# EAGLE schematic RK3188-EVB_Rev_C (EAGLE 9.6.2)
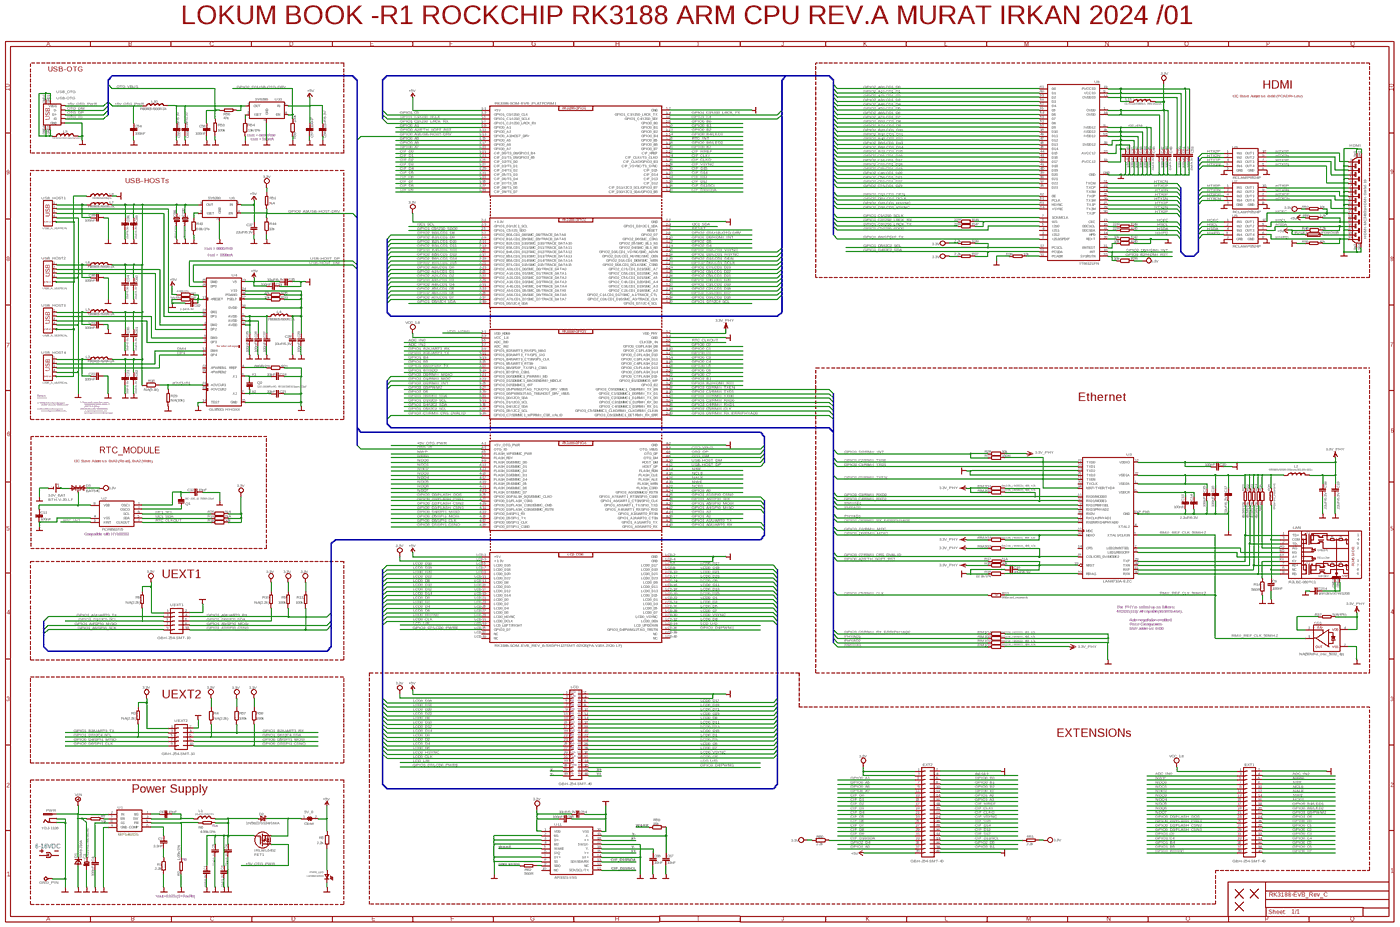
[diagram p0: schematic, sheet 1, overview]
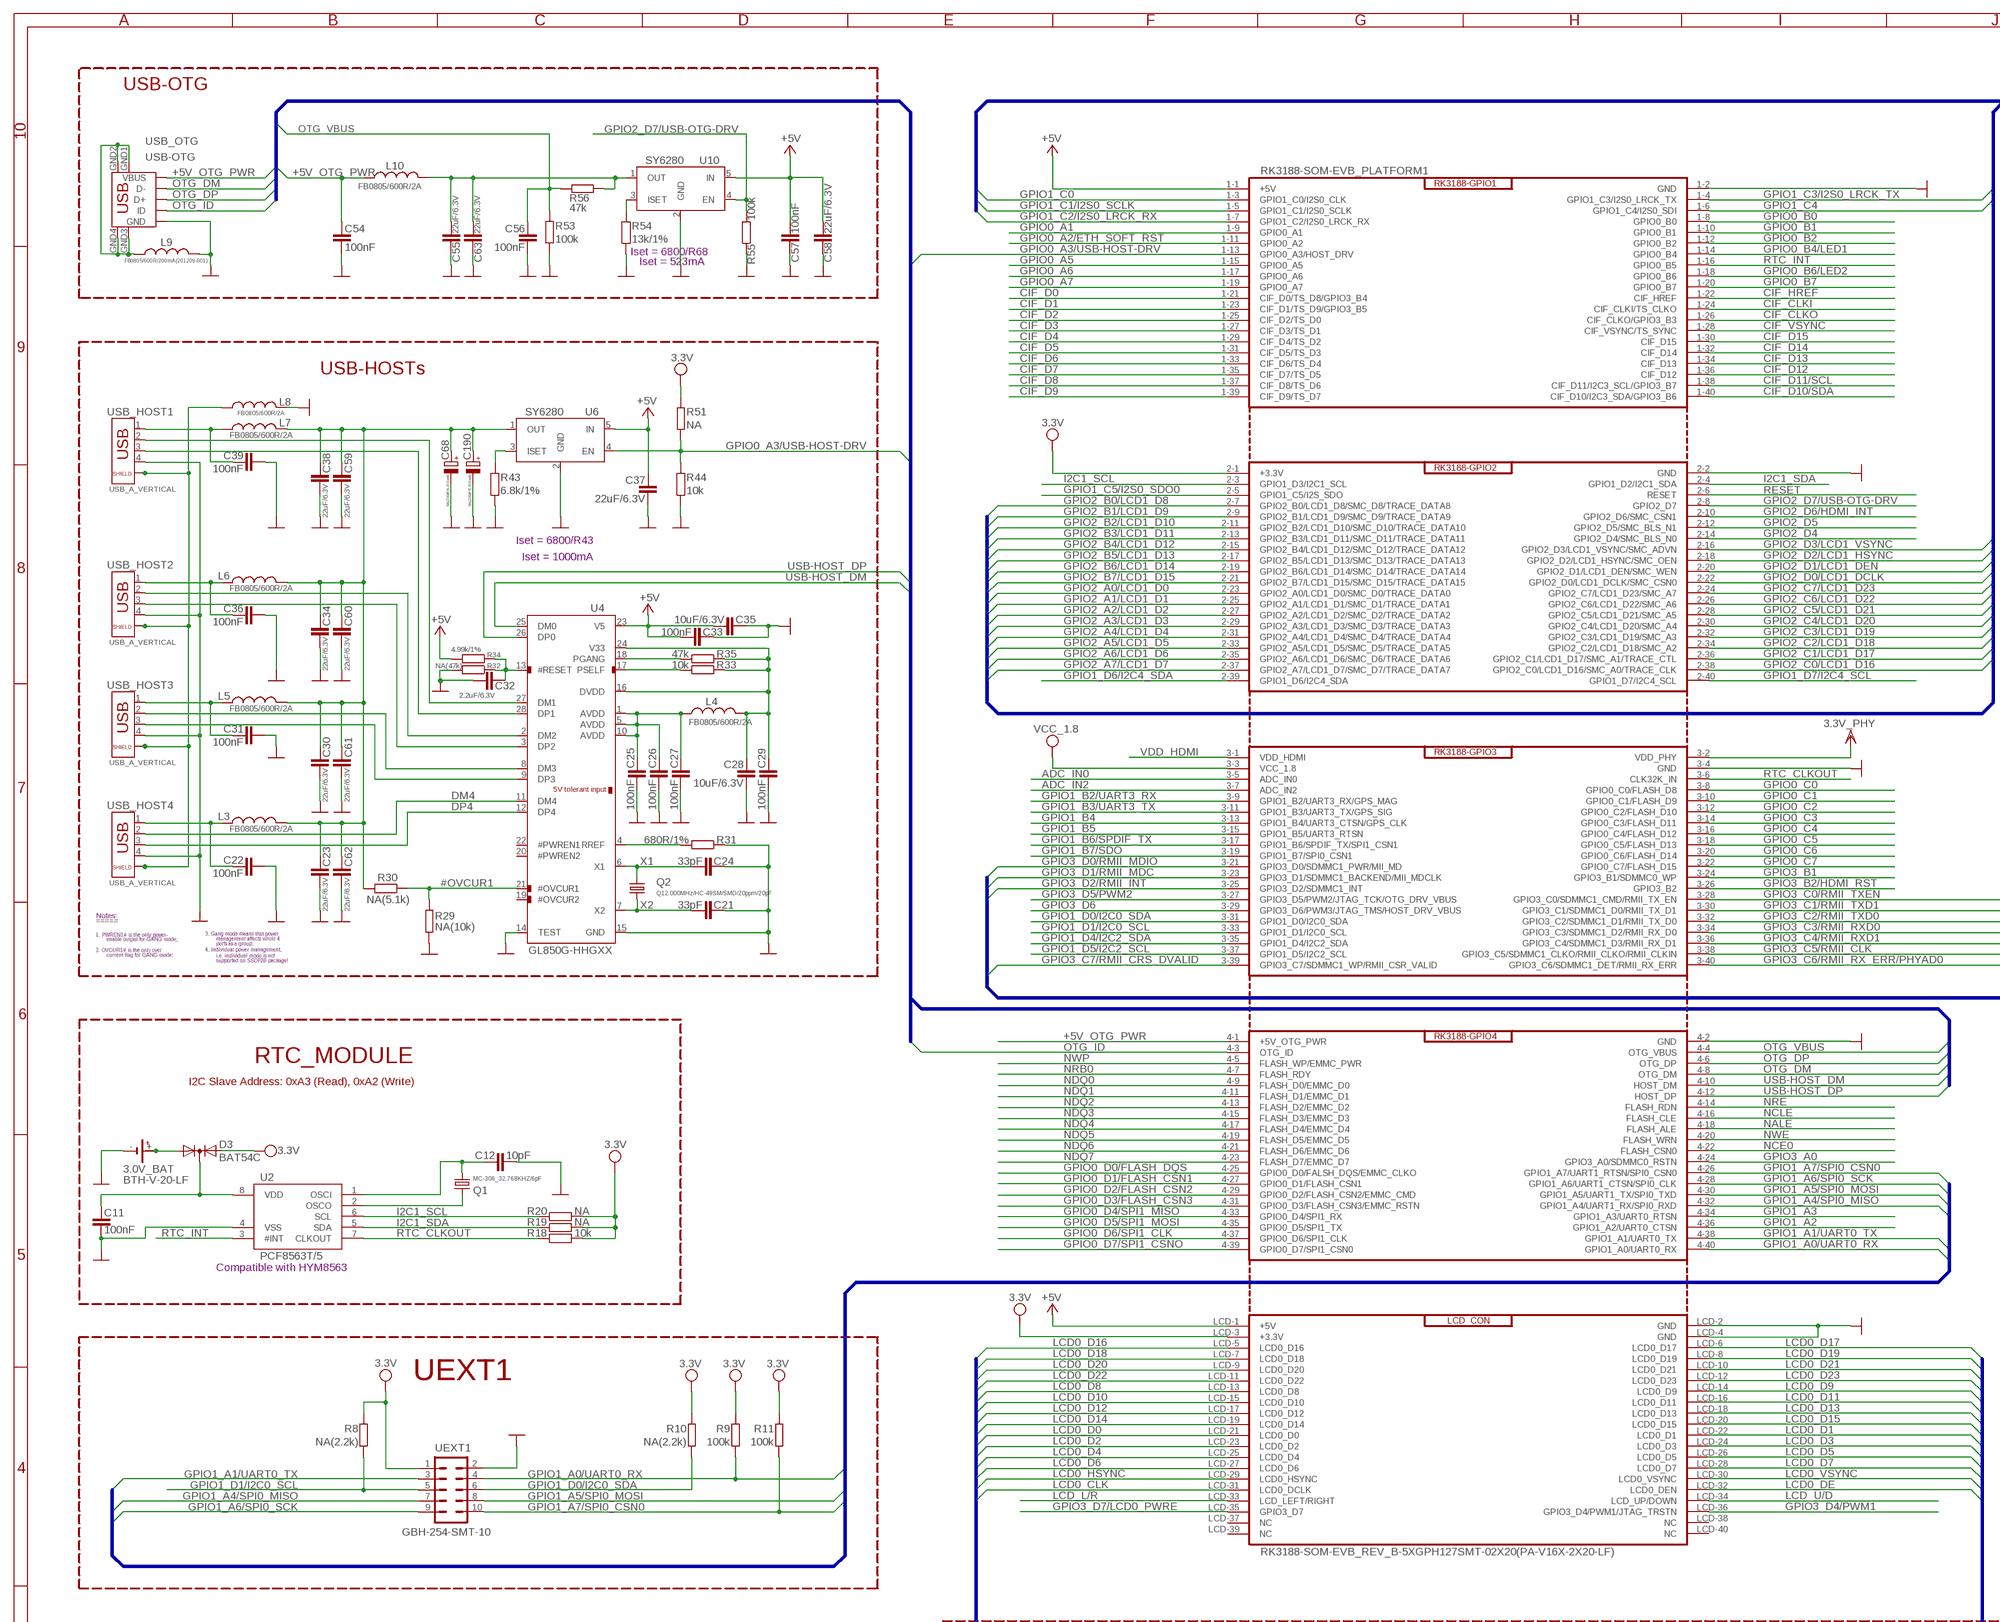
[diagram p1: schematic, sheet 1, part 1 of 4]
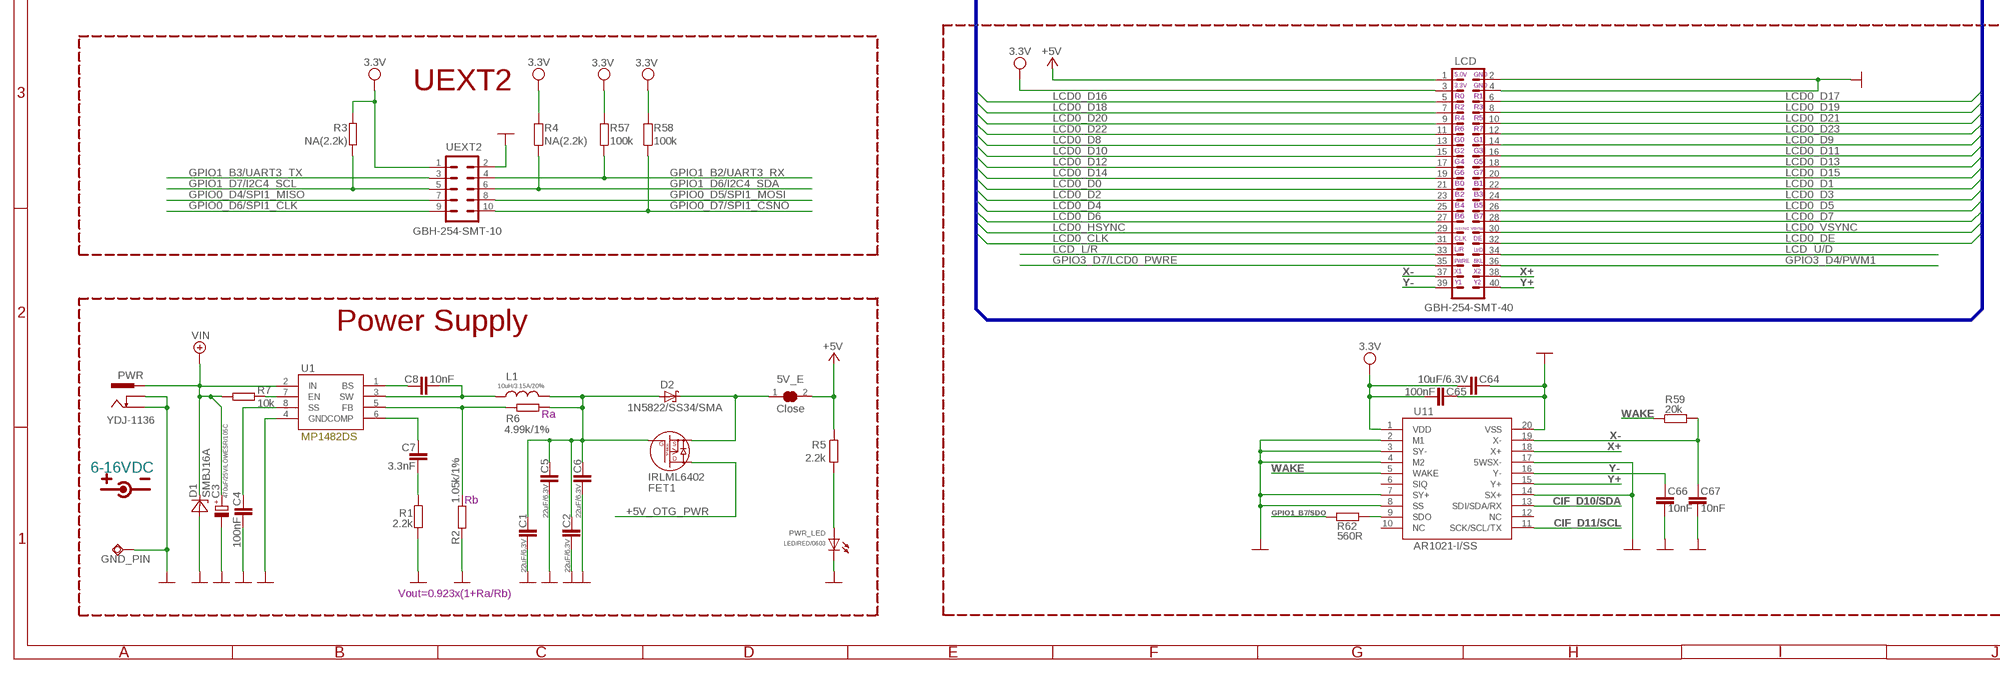
[diagram p2: schematic, sheet 1, part 2 of 4]
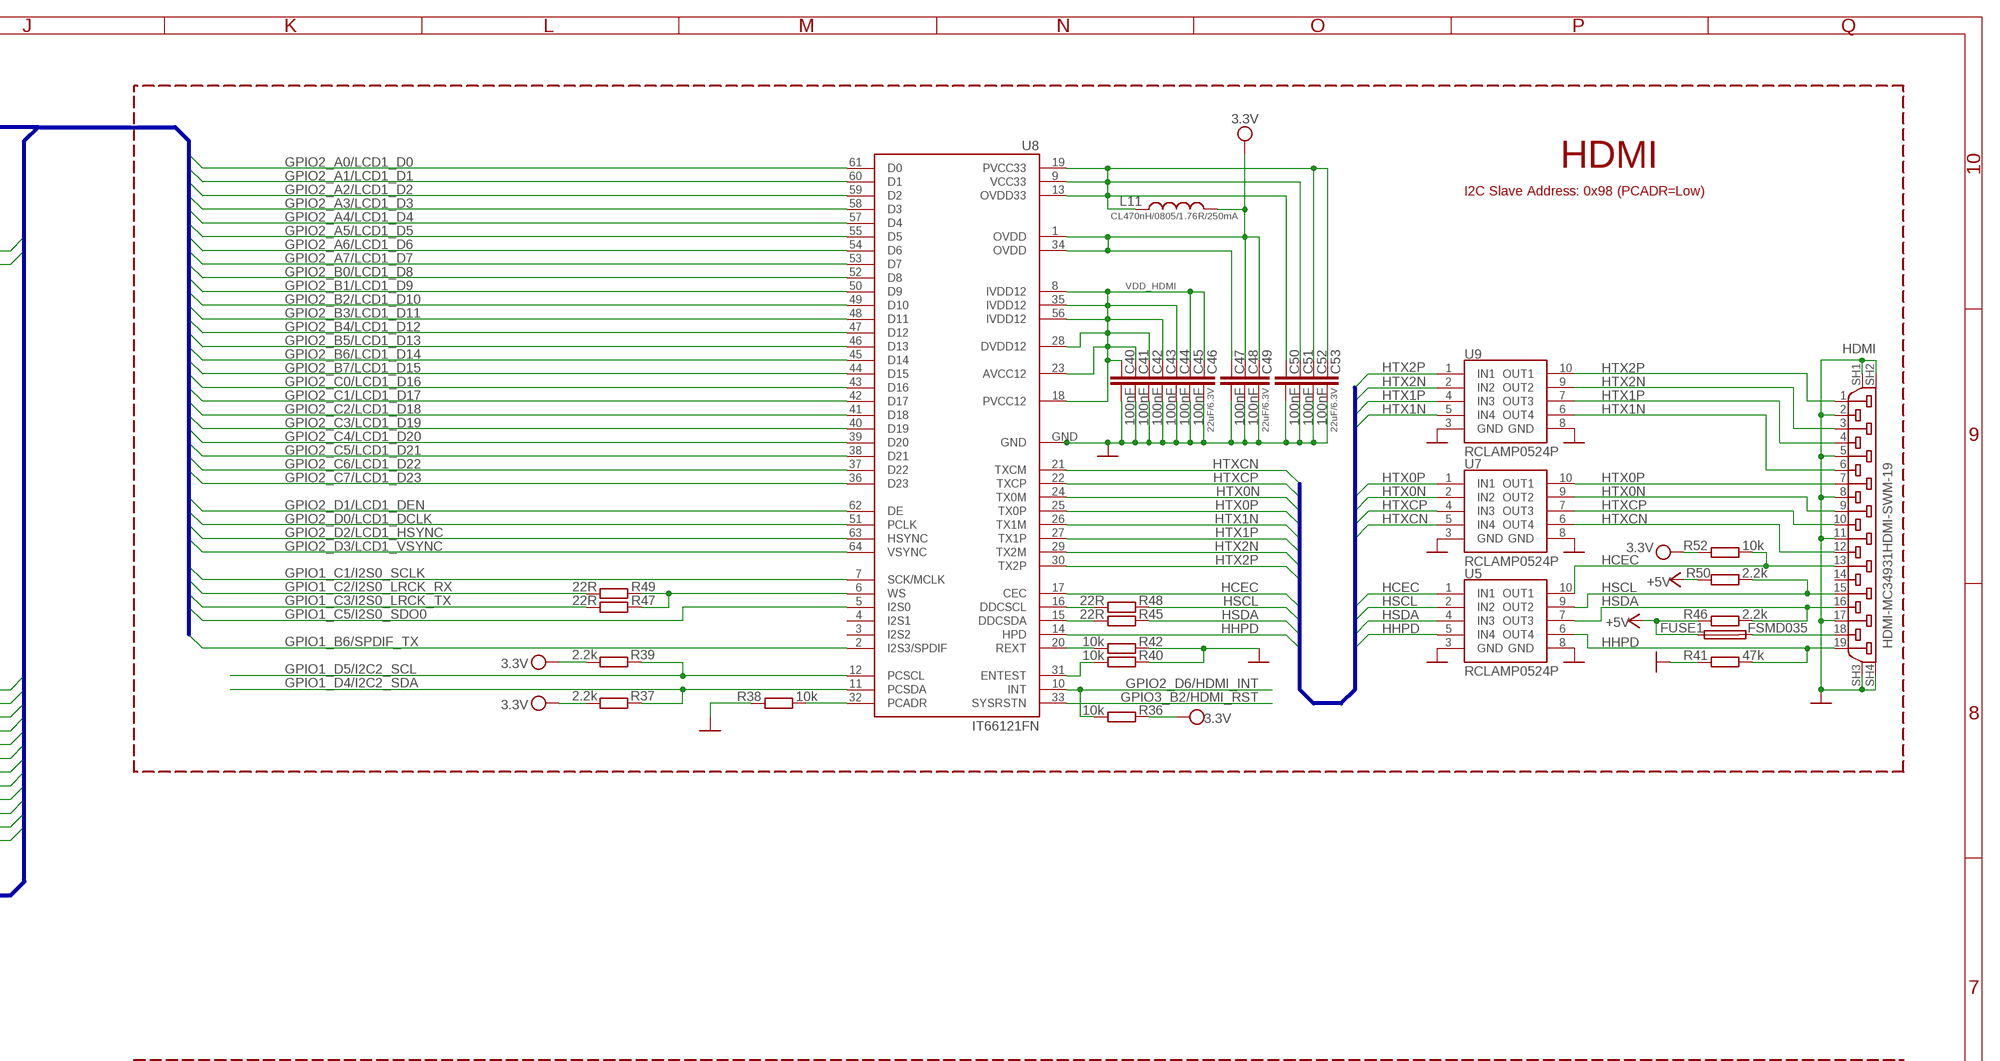
[diagram p3: schematic, sheet 1, part 3 of 4]
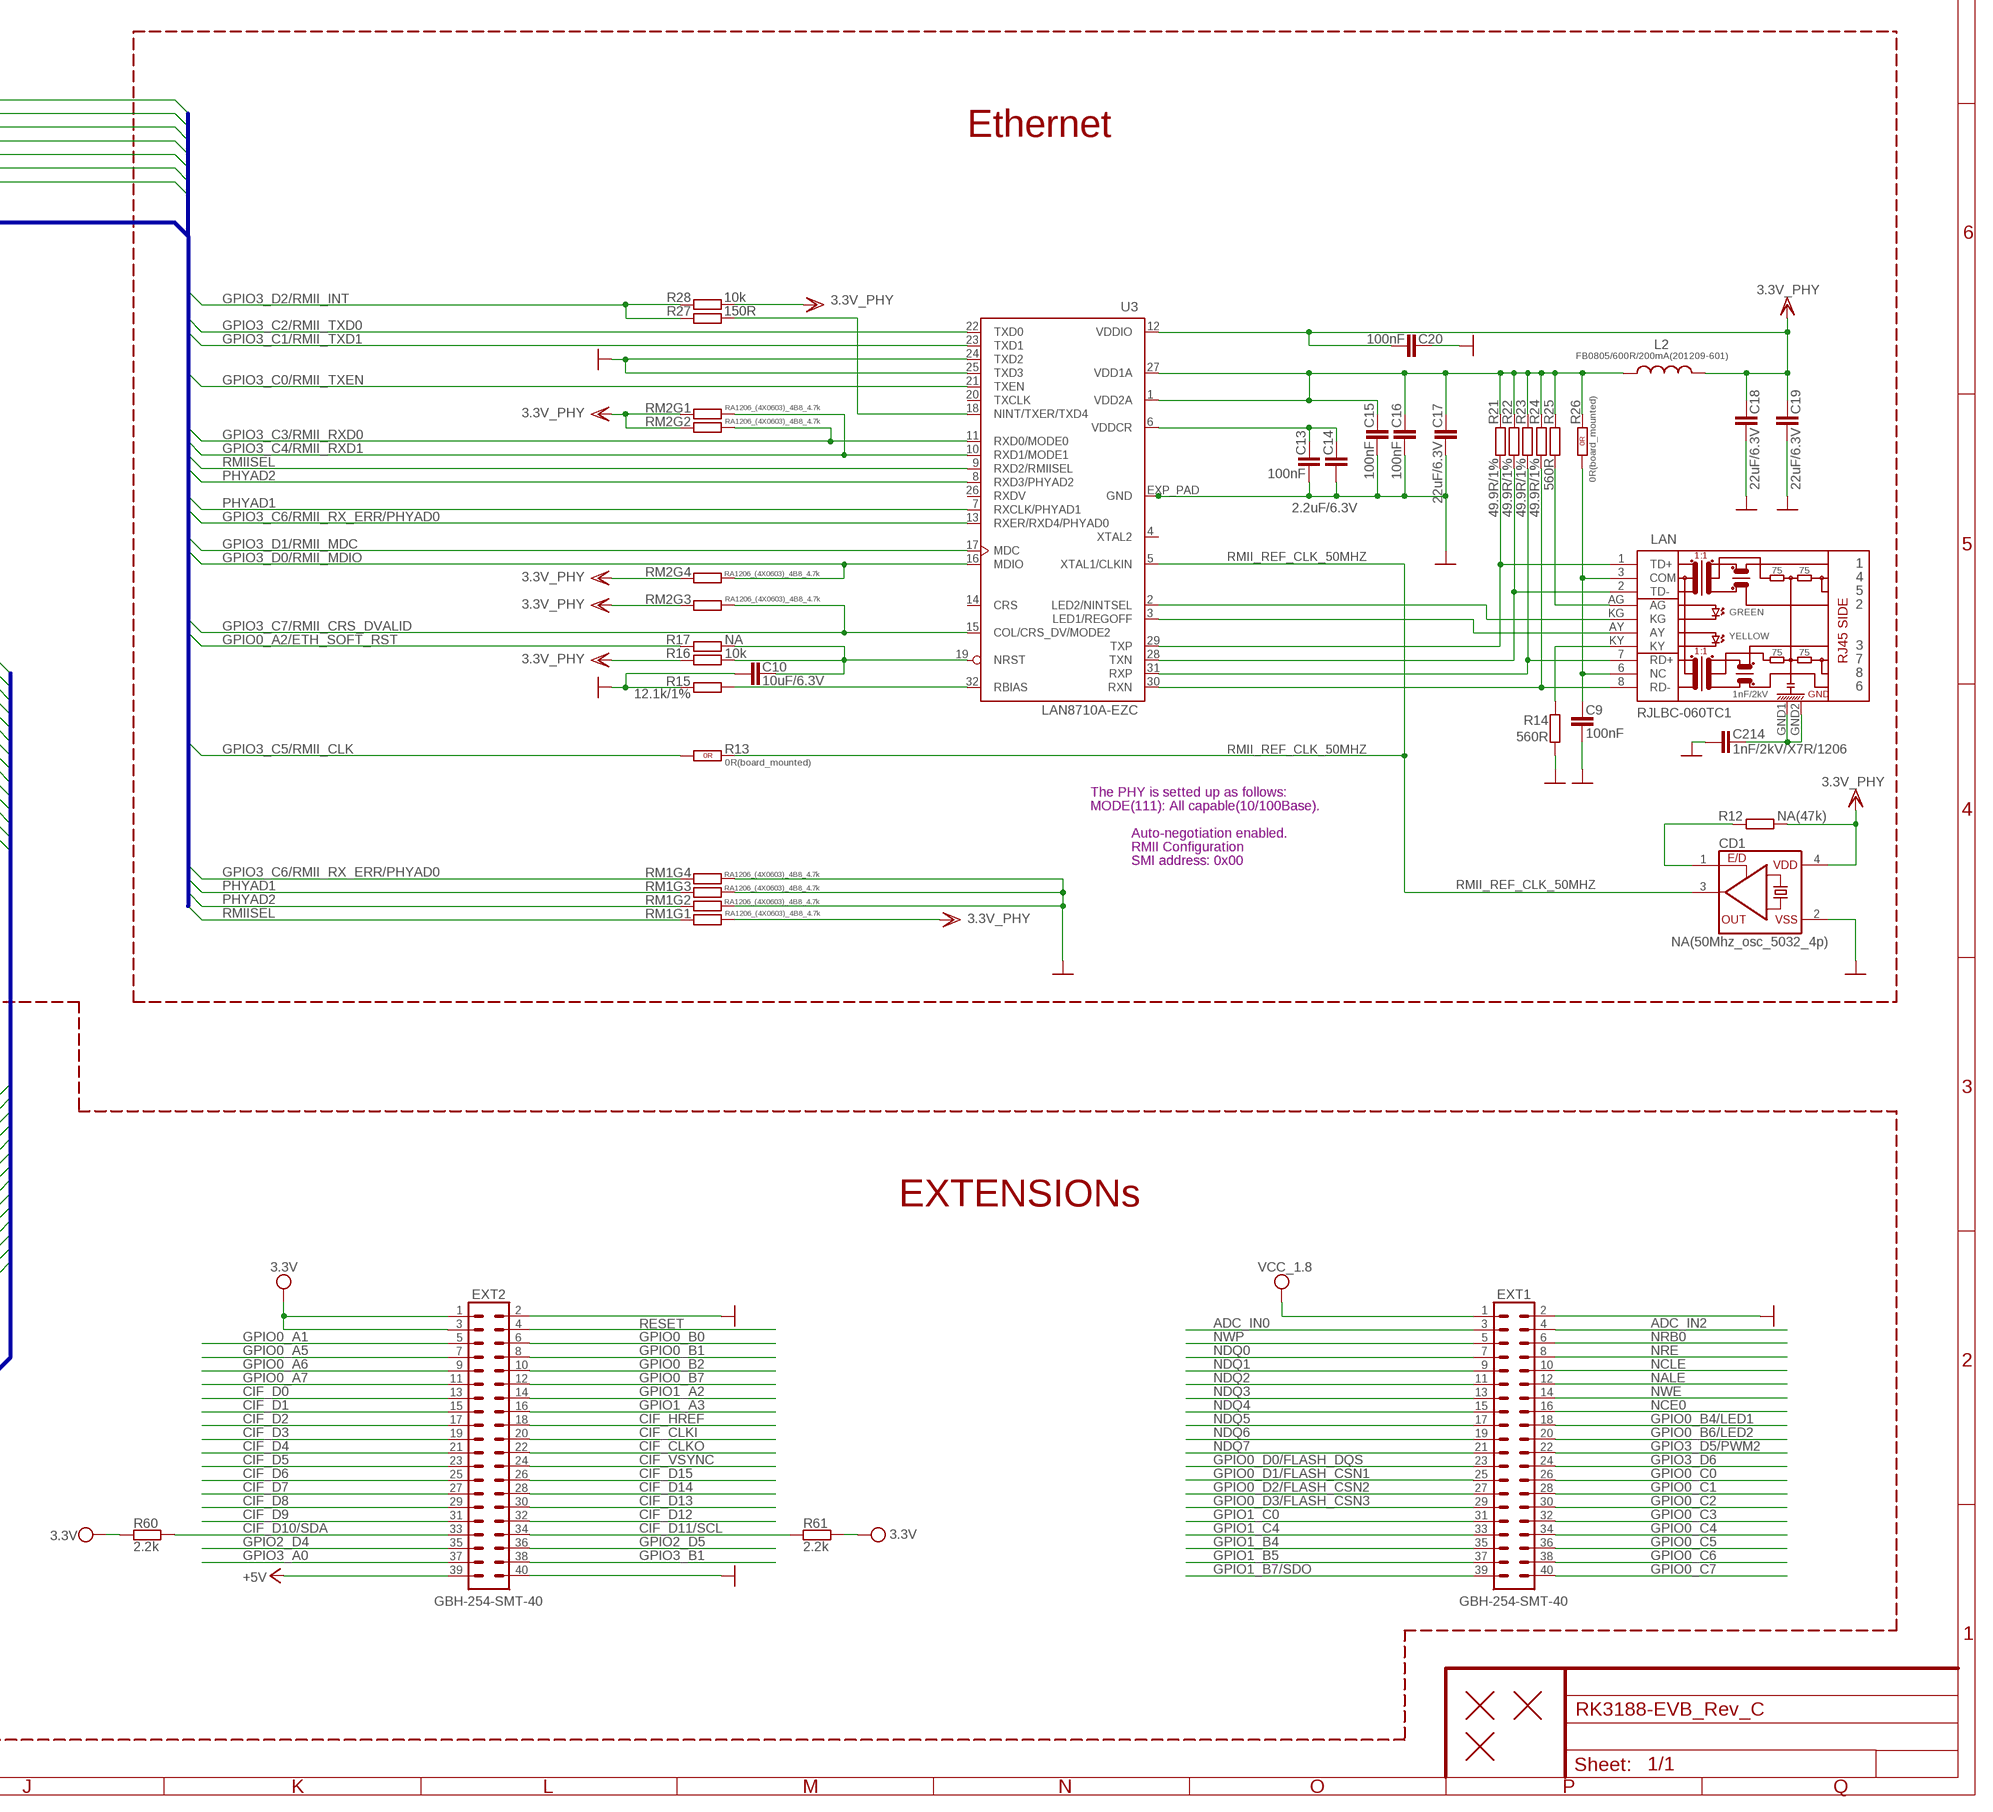
[diagram p4: schematic, sheet 1, part 4 of 4]

## Parts
3.0V_BAT  BTH-V-20-LF  B1  [3V_BAT_HOLDER]
5V_E  Close  SJSJ-CLOSE  [SJ-CLOSE]
C1  22uF/6.3V  C-EUC0603_DWS  [C0603_DWS]
C2  22uF/6.3V  C-EUC0603_DWS  [C0603_DWS]
C3  470uF/25V/LOWESR/105C  CPOL-EUE5-10.5  [E5-10,5]
C4  100nF  C-EUC0603_DWS  [C0603_DWS]
C5  22uF/6.3V  C-EUC0603_DWS  [C0603_DWS]
C6  22uF/6.3V  C-EUC0603_DWS  [C0603_DWS]
C7  3.3nF  C-EUC0603_DWS  [C0603_DWS]
C8  10nF  C-EUC0603_DWS  [C0603_DWS]
C9  100nF  C-EUC0603_DWS  [C0603_DWS]
C10  10uF/6.3V  C-EUC0603_DWS  [C0603_DWS]
C11  100nF  C-EUC0603_DWS  [C0603_DWS]
C12  10pF  C-EUC0603_DWS  [C0603_DWS]
C13  100nF  C-EUC0603_DWS  [C0603_DWS]
C14  2.2uF/6.3V  C-EUC0603_DWS  [C0603_DWS]
C15  100nF  C-EUC0603_DWS  [C0603_DWS]
C16  100nF  C-EUC0603_DWS  [C0603_DWS]
C17  22uF/6.3V  C-EUC0603_DWS  [C0603_DWS]
C18  22uF/6.3V  C-EUC0603_DWS  [C0603_DWS]
C19  22uF/6.3V  C-EUC0603_DWS  [C0603_DWS]
C20  100nF  C-EUC0603_DWS  [C0603_DWS]
C21  33pF  C-EUC0603_DWS  [C0603_DWS]
C22  100nF  C-EUC0603_DWS  [C0603_DWS]
C23  22uF/6.3V  C-EUC0603_DWS  [C0603_DWS]
C24  33pF  C-EUC0603_DWS  [C0603_DWS]
C25  100nF  C-EUC0603_DWS  [C0603_DWS]
C26  100nF  C-EUC0603_DWS  [C0603_DWS]
C27  100nF  C-EUC0603_DWS  [C0603_DWS]
C28  10uF/6.3V  C-EUC0603_DWS  [C0603_DWS]
C29  100nF  C-EUC0603_DWS  [C0603_DWS]
C30  22uF/6.3V  C-EUC0603_DWS  [C0603_DWS]
C31  100nF  C-EUC0603_DWS  [C0603_DWS]
C32  2.2uF/6.3V  C-EUC0603_DWS  [C0603_DWS]
C33  100nF  C-EUC0603_DWS  [C0603_DWS]
C34  22uF/6.3V  C-EUC0603_DWS  [C0603_DWS]
C35  10uF/6.3V  C-EUC0603_DWS  [C0603_DWS]
C36  100nF  C-EUC0603_DWS  [C0603_DWS]
C37  22uF/6.3V  C-EUC0603_DWS  [C0603_DWS]
C38  22uF/6.3V  C-EUC0603_DWS  [C0603_DWS]
C39  100nF  C-EUC0603_DWS  [C0603_DWS]
C40  100nF  C-EUC0603_DWS  [C0603_DWS]
C41  100nF  C-EUC0603_DWS  [C0603_DWS]
C42  100nF  C-EUC0603_DWS  [C0603_DWS]
C43  100nF  C-EUC0603_DWS  [C0603_DWS]
C44  100nF  C-EUC0603_DWS  [C0603_DWS]
C45  100nF  C-EUC0603_DWS  [C0603_DWS]
C46  22uF/6.3V  C-EUC0603_DWS  [C0603_DWS]
C47  100nF  C-EUC0603_DWS  [C0603_DWS]
C48  100nF  C-EUC0603_DWS  [C0603_DWS]
C49  22uF/6.3V  C-EUC0603_DWS  [C0603_DWS]
C50  100nF  C-EUC0603_DWS  [C0603_DWS]
C51  100nF  C-EUC0603_DWS  [C0603_DWS]
C52  100nF  C-EUC0603_DWS  [C0603_DWS]
C53  22uF/6.3V  C-EUC0603_DWS  [C0603_DWS]
C54  100nF  C-EUC0603_DWS  [C0603_DWS]
C55  22uF/6.3V  C-EUC0603_DWS  [C0603_DWS]
C56  100nF  C-EUC0603_DWS  [C0603_DWS]
C57  100nF  C-EUC0603_DWS  [C0603_DWS]
C58  22uF/6.3V  C-EUC0603_DWS  [C0603_DWS]
C59  22uF/6.3V  C-EUC0603_DWS  [C0603_DWS]
C60  22uF/6.3V  C-EUC0603_DWS  [C0603_DWS]
C61  22uF/6.3V  C-EUC0603_DWS  [C0603_DWS]
C62  22uF/6.3V  C-EUC0603_DWS  [C0603_DWS]
C63  22uF/6.3V  C-EUC0603_DWS  [C0603_DWS]
C64  10uF/6.3V  C-EUC0603_DWS  [C0603_DWS]
C65  100nF  C-EUC0603_DWS  [C0603_DWS]
C66  10nF  C-EUC0603_DWS  [C0603_DWS]
C67  10nF  C-EUC0603_DWS  [C0603_DWS]
C68  NA(220uF/6.3V/tant)  CPOL-EUCT6032  [CT6032]
C190  NA(220uF/6.3V/tant)  CPOL-EUCT6032  [CT6032]
C214  1nF/2kV/X7R/1206  C-EUC1206_5MILS_WS_ISO  [C1206_5MILS_WS_ISO]
CD1  NA(50Mhz_osc_5032_4p)  6NC2_CLOCK_DRIVER5032_4P  [5032-4P_HCX-3S]
D1  SMBJ16A  [DO214AA]
D2  1N5822/SS34/SMA  SCHOTKKY7.62SS2  [MLL-41]
D3  BAT54C  DIODE_AC-CA_  [SOT23C]
EXT1  GBH-254-SMT-40  ML40-GBH-254-SMT-40  [ML40-MALE(GBH-254-SMT-40)]
EXT2  GBH-254-SMT-40  ML40-GBH-254-SMT-40  [ML40-MALE(GBH-254-SMT-40)]
FET1  IRLML6402  P-MOS+DIODIRLML6402  [SOT23]
FID1  FIDUCIAL  [FIDUCIAL-1X3]
FID3  FIDUCIAL  [FIDUCIAL-1X3]
FID4  FIDUCIAL  [FIDUCIAL-1X3]
FUSE1  FSMD035  FUSE  [1206]
GND_PIN  TESTPAD3  [TEST_PAD40/70/SQUARE]
HDMI  HDMI-MC34931HDMI-SWM-19  [HDMI-SWM-19]
L1  10uH/3.15A/20%  LLQH88PN100M38  [8X8MM_3131]
L2  FB0805/600R/200mA(201209-601)  L-USL0805_5MIL_DWS  [L0805_5MIL_DWS]
L3  FB0805/600R/2A  L-USL0805_5MIL_DWS  [L0805_5MIL_DWS]
L4  FB0805/600R/2A  L-USL0805_5MIL_DWS  [L0805_5MIL_DWS]
L5  FB0805/600R/2A  L-USL0805_5MIL_DWS  [L0805_5MIL_DWS]
L6  FB0805/600R/2A  L-USL0805_5MIL_DWS  [L0805_5MIL_DWS]
L7  FB0805/600R/2A  L-USL0805_5MIL_DWS  [L0805_5MIL_DWS]
L8  FB0805/600R/2A  L-USL0805_5MIL_DWS  [L0805_5MIL_DWS]
L9  FB0805/600R/200mA(201209-601)  L-USL0805_5MIL_DWS  [L0805_5MIL_DWS]
L10  FB0805/600R/2A  L-USL0805_5MIL_DWS  [L0805_5MIL_DWS]
L11  CL470nH/0805/1.76R/250mA  L-USL0805_5MIL_DWS  [L0805_5MIL_DWS]
LAN  RJLBC-060TC1  RJLBC-060TC1_GND_MILLING  [RJLBC-060TC1_MILLING]
LCD  GBH-254-SMT-40  ML40-GBH-254-SMT-40  [ML40-MALE(GBH-254-SMT-40)]
PWR  YDJ-1136  PWR-JAKPWR_JACK_UNI_MILLING  [PWR_JACK_UNI_MILLING]
PWR_LED  LED/RED/0603  LED0603DWS  [LED-0603]
Q1  MC-306_32.768KHZ/6pF  MC-306_32.768KHZ/SMD_8038  [MC-306]
Q2  Q12.000MHz/HC-49SM/SMD/20ppm/20pF  HC49/S1  [HC49/SMD2_THIN]
R1  2.2k  R-EU_R0603_5MIL_DWS  [R0603_5MIL_DWS]
R2  1.05k/1%  R-EU_R0603_5MIL_DWS  [R0603_5MIL_DWS]
R3  NA(2.2k)  R-EU_R0603_5MIL_DWS  [R0603_5MIL_DWS]
R4  NA(2.2k)  R-EU_R0603_5MIL_DWS  [R0603_5MIL_DWS]
R5  2.2k  R-EU_R0603_5MIL_DWS  [R0603_5MIL_DWS]
R6  4.99k/1%  R-EU_R0603_5MIL_DWS  [R0603_5MIL_DWS]
R7  10k  R-EU_R0603_5MIL_DWS  [R0603_5MIL_DWS]
R8  NA(2.2k)  R-EU_R0603_5MIL_DWS  [R0603_5MIL_DWS]
R9  100k  R-EU_R0603_5MIL_DWS  [R0603_5MIL_DWS]
R10  NA(2.2k)  R-EU_R0603_5MIL_DWS  [R0603_5MIL_DWS]
R11  100k  R-EU_R0603_5MIL_DWS  [R0603_5MIL_DWS]
R12  NA(47k)  R-EU_R0603_5MIL_DWS  [R0603_5MIL_DWS]
R13  0R(board_mounted)  R_0R0R(NA)  [0603_0R]
R14  560R  R-EU_R0603_5MIL_DWS  [R0603_5MIL_DWS]
R15  12.1k/1%  R-EU_R0603_5MIL_DWS  [R0603_5MIL_DWS]
R16  10k  R-EU_R0603_5MIL_DWS  [R0603_5MIL_DWS]
R17  NA  R-EU_R0603_5MIL_DWS  [R0603_5MIL_DWS]
R18  10k  R-EU_R0603_5MIL_DWS  [R0603_5MIL_DWS]
R19  NA  R-EU_R0603_5MIL_DWS  [R0603_5MIL_DWS]
R20  NA  R-EU_R0603_5MIL_DWS  [R0603_5MIL_DWS]
R21  49.9R/1%  R-EU_R0603_5MIL_DWS  [R0603_5MIL_DWS]
R22  49.9R/1%  R-EU_R0603_5MIL_DWS  [R0603_5MIL_DWS]
R23  49.9R/1%  R-EU_R0603_5MIL_DWS  [R0603_5MIL_DWS]
R24  49.9R/1%  R-EU_R0603_5MIL_DWS  [R0603_5MIL_DWS]
R25  560R  R-EU_R0603_5MIL_DWS  [R0603_5MIL_DWS]
R26  0R(board_mounted)  R_0R0R(NA)  [0603_0R]
R27  150R  R-EU_R0603_5MIL_DWS  [R0603_5MIL_DWS]
R28  10k  R-EU_R0603_5MIL_DWS  [R0603_5MIL_DWS]
R29  NA(10k)  R-EU_R0603_5MIL_DWS  [R0603_5MIL_DWS]
R30  NA(5.1k)  R-EU_R0603_5MIL_DWS  [R0603_5MIL_DWS]
R31  680R/1%  R-EU_R0603_5MIL_DWS  [R0603_5MIL_DWS]
R32  NA(47k)  R-EU_R0603_5MIL_DWS  [R0603_5MIL_DWS]
R33  10k  R-EU_R0603_5MIL_DWS  [R0603_5MIL_DWS]
R34  4.99k/1%  R-EU_R0603_5MIL_DWS  [R0603_5MIL_DWS]
R35  47k  R-EU_R0603_5MIL_DWS  [R0603_5MIL_DWS]
R36  10k  R-EU_R0603_5MIL_DWS  [R0603_5MIL_DWS]
R37  2.2k  R-EU_R0603_5MIL_DWS  [R0603_5MIL_DWS]
R38  10k  R-EU_R0603_5MIL_DWS  [R0603_5MIL_DWS]
R39  2.2k  R-EU_R0603_5MIL_DWS  [R0603_5MIL_DWS]
R40  10k  R-EU_R0603_5MIL_DWS  [R0603_5MIL_DWS]
R41  47k  R-EU_R0603_5MIL_DWS  [R0603_5MIL_DWS]
R42  10k  R-EU_R0603_5MIL_DWS  [R0603_5MIL_DWS]
R43  6.8k/1%  R-EU_R0603_5MIL_DWS  [R0603_5MIL_DWS]
R44  10k  R-EU_R0603_5MIL_DWS  [R0603_5MIL_DWS]
R45  22R  R-EU_R0603_5MIL_DWS  [R0603_5MIL_DWS]
R46  2.2k  R-EU_R0603_5MIL_DWS  [R0603_5MIL_DWS]
R47  22R  R-EU_R0603_5MIL_DWS  [R0603_5MIL_DWS]
R48  22R  R-EU_R0603_5MIL_DWS  [R0603_5MIL_DWS]
R49  22R  R-EU_R0603_5MIL_DWS  [R0603_5MIL_DWS]
R50  2.2k  R-EU_R0603_5MIL_DWS  [R0603_5MIL_DWS]
R51  NA  R-EU_R0603_5MIL_DWS  [R0603_5MIL_DWS]
R52  10k  R-EU_R0603_5MIL_DWS  [R0603_5MIL_DWS]
R53  100k  R-EU_R0603_5MIL_DWS  [R0603_5MIL_DWS]
R54  13k/1%  R-EU_R0603_5MIL_DWS  [R0603_5MIL_DWS]
R55  100k  R-EU_R0603_5MIL_DWS  [R0603_5MIL_DWS]
R56  47k  R-EU_R0603_5MIL_DWS  [R0603_5MIL_DWS]
R57  100k  R-EU_R0603_5MIL_DWS  [R0603_5MIL_DWS]
R58  100k  R-EU_R0603_5MIL_DWS  [R0603_5MIL_DWS]
R59  20k  R-EU_R0603_5MIL_DWS  [R0603_5MIL_DWS]
R60  2.2k  R-EU_R0603_5MIL_DWS  [R0603_5MIL_DWS]
R61  2.2k  R-EU_R0603_5MIL_DWS  [R0603_5MIL_DWS]
R62  560R  R-EU_R0603_5MIL_DWS  [R0603_5MIL_DWS]
RK3188-SOM-EVB_PLATFORM1  RK3188-SOM-EVB_REV_B-5XGPH127SMT-02X20(PA-V16X-2X20-LF)  [RK3188-SOM-EVB_REV_B]
RM1  RA1206_(4X0603)_4B8_4.7k  R_MATRIX_4E  [R_MATRIX_4]
RM2  RA1206_(4X0603)_4B8_4.7k  R_MATRIX_4E  [R_MATRIX_4]
U1  MP1482DS  MP1482  [SOIC8]
U2  PCF8563T/5  PCF8563  [SO-8]
U3  LAN8710A-EZC  [QFN-32(DRILLS)]
U4  GL850G-HHGXX  GL850G  [SSOP28]
U5  RCLAMP0524P  [SLP2510P8]
U6  SY6280  [SOT23-5]
U7  RCLAMP0524P  [SLP2510P8]
U8  IT66121FN  [QFN64(IT66121FN)]
U9  RCLAMP0524P  [SLP2510P8]
U10  SY6280  [SOT23-5]
U11  AR1021-I/SS  AR1020-I/SS  [SSOP20]
UEXT1  GBH-254-SMT-10  ML10MD  [ML10_S]
UEXT2  GBH-254-SMT-10  ML10MD  [ML10_S]
USB_HOST1  USB_A_VERTICAL  USB_SHIELDUSB_A_VERTICAL  [USB_A_VERTICAL_PTH]
USB_HOST2  USB_A_VERTICAL  USB_SHIELDUSB_A_VERTICAL  [USB_A_VERTICAL_PTH]
USB_HOST3  USB_A_VERTICAL  USB_SHIELDUSB_A_VERTICAL  [USB_A_VERTICAL_PTH]
USB_HOST4  USB_A_VERTICAL  USB_SHIELDUSB_A_VERTICAL  [USB_A_VERTICAL_PTH]
USB_OTG  USB-OTG  MINI_USB9  [USB_MINI_9PIN]

## Nets
#OVCUR1: R29.2 R30.1 U4.21(#OVCUR1)
+5V: 5V_E.2 C33.1 C35.1 C37.1 C57.1 C58.1 EXT2.39 FUSE1.1 LCD.1 R5.1 R34.2 R46.2 R50.2 RK3188-SOM-EVB_PLATFORM1.1-1(+5V) RK3188-SOM-EVB_PLATFORM1.LCD-1(+5V) U4.23(V5) U6.5(IN) U10.5(IN)
+5V_OTG_PWR: C54.1 FET1.3(D) L10.1 RK3188-SOM-EVB_PLATFORM1.4-1(+5V_OTG_PWR) USB_OTG.VBUS
+12V: C3.+ D1.C PWR.+ R7.1 U1.2(IN) ; supply symbol labelled VIN
ADC_IN0: EXT1.3 RK3188-SOM-EVB_PLATFORM1.3-5(ADC_IN0)
ADC_IN2: EXT1.4 RK3188-SOM-EVB_PLATFORM1.3-7(ADC_IN2)
AVDD2: C25.1 C26.1 C27.1 L4.2 U4.1(AVDD) U4.5(AVDD) U4.10(AVDD)
CIF_CLKI: EXT2.20 RK3188-SOM-EVB_PLATFORM1.1-24(CIF_CLKI/TS_CLKO)
CIF_CLKO: EXT2.22 RK3188-SOM-EVB_PLATFORM1.1-26(CIF_CLKO/GPIO3_B3)
CIF_D0: EXT2.13 RK3188-SOM-EVB_PLATFORM1.1-21(CIF_D0/TS_D8/GPIO3_B4)
CIF_D1: EXT2.15 RK3188-SOM-EVB_PLATFORM1.1-23(CIF_D1/TS_D9/GPIO3_B5)
CIF_D2: EXT2.17 RK3188-SOM-EVB_PLATFORM1.1-25(CIF_D2/TS_D0)
CIF_D3: EXT2.19 RK3188-SOM-EVB_PLATFORM1.1-27(CIF_D3/TS_D1)
CIF_D4: EXT2.21 RK3188-SOM-EVB_PLATFORM1.1-29(CIF_D4/TS_D2)
CIF_D5: EXT2.23 RK3188-SOM-EVB_PLATFORM1.1-31(CIF_D5/TS_D3)
CIF_D6: EXT2.25 RK3188-SOM-EVB_PLATFORM1.1-33(CIF_D6/TS_D4)
CIF_D7: EXT2.27 RK3188-SOM-EVB_PLATFORM1.1-35(CIF_D7/TS_D5)
CIF_D8: EXT2.29 RK3188-SOM-EVB_PLATFORM1.1-37(CIF_D8/TS_D6)
CIF_D9: EXT2.31 RK3188-SOM-EVB_PLATFORM1.1-39(CIF_D9/TS_D7)
CIF_D10/SDA: EXT2.33 R60.1 RK3188-SOM-EVB_PLATFORM1.1-40(CIF_D10/I2C3_SDA/GPIO3_B6) U11.13(SDI/SDA/RX)
CIF_D11/SCL: EXT2.34 R61.1 RK3188-SOM-EVB_PLATFORM1.1-38(CIF_D11/I2C3_SCL/GPIO3_B7) U11.11(SCK/SCL/TX)
CIF_D12: EXT2.32 RK3188-SOM-EVB_PLATFORM1.1-36(CIF_D12)
CIF_D13: EXT2.30 RK3188-SOM-EVB_PLATFORM1.1-34(CIF_D13)
CIF_D14: EXT2.28 RK3188-SOM-EVB_PLATFORM1.1-32(CIF_D14)
CIF_D15: EXT2.26 RK3188-SOM-EVB_PLATFORM1.1-30(CIF_D15)
CIF_HREF: EXT2.18 RK3188-SOM-EVB_PLATFORM1.1-22(CIF_HREF)
CIF_VSYNC: EXT2.24 RK3188-SOM-EVB_PLATFORM1.1-28(CIF_VSYNC/TS_SYNC)
DM1: U4.27(DM1) USB_HOST1.2
DM2: U4.2(DM2) USB_HOST2.2
DM3: U4.8(DM3) USB_HOST3.2
DM4: U4.11(DM4) USB_HOST4.2
DP1: U4.28(DP1) USB_HOST1.3
DP2: U4.3(DP2) USB_HOST2.3
DP3: U4.9(DP3) USB_HOST3.3
DP4: U4.12(DP4) USB_HOST4.3
DVDD1: C28.1 C29.1 L4.1 R33.1 R35.1 U4.16(DVDD) U4.24(V33)
GND [PWR]: 3.0V_BAT.- C1.2 C2.2 C3.- C4.2 C5.2 C6.2 C9.1 C10.1 C11.1 C12.2 C13.1 C14.1 C15.1 C16.1 C17.1 C18.1 C19.1 C20.1 C21.1 C22.2 C23.1 C24.1 C25.2 C26.2 C27.2 C28.2 C29.2 C30.1 C31.2 C32.1 C33.2 C34.1 C35.2 C36.2 C37.2 C38.1 C39.2 C40.2 C41.2 C42.2 C43.2 C44.2 C45.2 C46.2 C47.2 C48.2 C49.2 C50.2 C51.2 C52.2 C53.2 C54.2 C55.2 C56.2 C57.2 C58.2 C59.1 C60.1 C61.1 C62.1 C63.2 C64.2 C65.2 C66.1 C67.1 C68.- C190.- C214.2 CD1.2(VSS) D1.A EXT1.2 EXT2.2 EXT2.40 GND_PIN.P$1(PP) HDMI.2 HDMI.5 HDMI.8 HDMI.11 HDMI.17 HDMI.SH1 HDMI.SH2 HDMI.SH3 HDMI.SH4 L8.1 L9.1 LCD.2 LCD.4 PWR.- PWR.-- PWR_LED.C R1.2 R2.2 R14.2 R15.1 R29.1 R31.1 R32.2 R38.2 R40.2 R41.2 R42.2 R43.1 R44.1 R53.1 R54.1 R55.1 RK3188-SOM-EVB_PLATFORM1.1-2(GND) RK3188-SOM-EVB_PLATFORM1.2-2(GND) RK3188-SOM-EVB_PLATFORM1.3-4(GND) RK3188-SOM-EVB_PLATFORM1.4-2(GND) RK3188-SOM-EVB_PLATFORM1.LCD-2(GND) RK3188-SOM-EVB_PLATFORM1.LCD-4(GND) RM1.2.2 RM1.3.2 RM1.4.2 U1.4(GND) U2.4(VSS) U3.24(TXD2) U3.25(TXD3) U3.EP1(GND1) U3.EP2(GND2) U3.EP3(GND3) U3.EP4(GND4) U3.EP5(GND5) U3.EP6(GND6) U3.EP7(GND7) U3.EP8(GND8) U3.EP9(GND9) U3.EXP_PAD(GND) U4.14(TEST) U4.15(GND) U5.3(GND) U5.8(GND) U6.2(GND) U7.3(GND) U7.8(GND) U8.GND U8.GND1(GND) U8.GND2(GND) U8.GND3(GND) U8.GND4(GND) U8.GND5(GND) U9.3(GND) U9.8(GND) U10.2(GND) U11.2(M1) U11.3(SY-) U11.4(M2) U11.7(SY+) U11.8(SS) U11.14(SX+) U11.17(5WSX-) U11.20(VSS) UEXT1.2 UEXT2.2 USB_HOST1.4 USB_HOST2.4 USB_HOST3.4 USB_HOST4.4 USB_OTG.GND
GPIO0_A1: EXT2.5 RK3188-SOM-EVB_PLATFORM1.1-9(GPIO0_A1)
GPIO0_A2/ETH_SOFT_RST: R17.1 RK3188-SOM-EVB_PLATFORM1.1-11(GPIO0_A2)
GPIO0_A3/USB-HOST-DRV: R44.2 R51.2 RK3188-SOM-EVB_PLATFORM1.1-13(GPIO0_A3/HOST_DRV) U6.4(EN)
GPIO0_A5: EXT2.7 RK3188-SOM-EVB_PLATFORM1.1-15(GPIO0_A5)
GPIO0_A6: EXT2.9 RK3188-SOM-EVB_PLATFORM1.1-17(GPIO0_A6)
GPIO0_A7: EXT2.11 RK3188-SOM-EVB_PLATFORM1.1-19(GPIO0_A7)
GPIO0_B0: EXT2.6 RK3188-SOM-EVB_PLATFORM1.1-8(GPIO0_B0)
GPIO0_B1: EXT2.8 RK3188-SOM-EVB_PLATFORM1.1-10(GPIO0_B1)
GPIO0_B2: EXT2.10 RK3188-SOM-EVB_PLATFORM1.1-12(GPIO0_B2)
GPIO0_B4/LED1: EXT1.18 RK3188-SOM-EVB_PLATFORM1.1-14(GPIO0_B4)
GPIO0_B6/LED2: EXT1.20 RK3188-SOM-EVB_PLATFORM1.1-18(GPIO0_B6)
GPIO0_B7: EXT2.12 RK3188-SOM-EVB_PLATFORM1.1-20(GPIO0_B7)
GPIO0_C0: EXT1.26 RK3188-SOM-EVB_PLATFORM1.3-8(GPIO0_C0/FLASH_D8)
GPIO0_C1: EXT1.28 RK3188-SOM-EVB_PLATFORM1.3-10(GPIO0_C1/FLASH_D9)
GPIO0_C2: EXT1.30 RK3188-SOM-EVB_PLATFORM1.3-12(GPIO0_C2/FLASH_D10)
GPIO0_C3: EXT1.32 RK3188-SOM-EVB_PLATFORM1.3-14(GPIO0_C3/FLASH_D11)
GPIO0_C4: EXT1.34 RK3188-SOM-EVB_PLATFORM1.3-16(GPIO0_C4/FLASH_D12)
GPIO0_C5: EXT1.36 RK3188-SOM-EVB_PLATFORM1.3-18(GPIO0_C5/FLASH_D13)
GPIO0_C6: EXT1.38 RK3188-SOM-EVB_PLATFORM1.3-20(GPIO0_C6/FLASH_D14)
GPIO0_C7: EXT1.40 RK3188-SOM-EVB_PLATFORM1.3-22(GPIO0_C7/FLASH_D15)
GPIO0_D0/FLASH_DQS: EXT1.23 RK3188-SOM-EVB_PLATFORM1.4-25(GPIO0_D0/FALSH_DQS/EMMC_CLKO)
GPIO0_D1/FLASH_CSN1: EXT1.25 RK3188-SOM-EVB_PLATFORM1.4-27(GPIO0_D1/FLASH_CSN1)
GPIO0_D2/FLASH_CSN2: EXT1.27 RK3188-SOM-EVB_PLATFORM1.4-29(GPIO0_D2/FLASH_CSN2/EMMC_CMD)
GPIO0_D3/FLASH_CSN3: EXT1.29 RK3188-SOM-EVB_PLATFORM1.4-31(GPIO0_D3/FLASH_CSN3/EMMC_RSTN)
GPIO0_D4/SPI1_MISO: RK3188-SOM-EVB_PLATFORM1.4-33(GPIO0_D4/SPI1_RX) UEXT2.7
GPIO0_D5/SPI1_MOSI: RK3188-SOM-EVB_PLATFORM1.4-35(GPIO0_D5/SPI1_TX) UEXT2.8
GPIO0_D6/SPI1_CLK: RK3188-SOM-EVB_PLATFORM1.4-37(GPIO0_D6/SPI1_CLK) UEXT2.9
GPIO0_D7/SPI1_CSNO: R58.1 RK3188-SOM-EVB_PLATFORM1.4-39(GPIO0_D7/SPI1_CSN0) UEXT2.10
GPIO1_A0/UART0_RX: R9.1 RK3188-SOM-EVB_PLATFORM1.4-40(GPIO1_A0/UART0_RX) UEXT1.4
GPIO1_A1/UART0_TX: RK3188-SOM-EVB_PLATFORM1.4-38(GPIO1_A1/UART0_TX) UEXT1.3
GPIO1_A2: EXT2.14 RK3188-SOM-EVB_PLATFORM1.4-36(GPIO1_A2/UART0_CTSN)
GPIO1_A3: EXT2.16 RK3188-SOM-EVB_PLATFORM1.4-34(GPIO1_A3/UART0_RTSN)
GPIO1_A4/SPI0_MISO: RK3188-SOM-EVB_PLATFORM1.4-32(GPIO1_A4/UART1_RX/SPI0_RXD) UEXT1.7
GPIO1_A5/SPI0_MOSI: RK3188-SOM-EVB_PLATFORM1.4-30(GPIO1_A5/UART1_TX/SPI0_TXD) UEXT1.8
GPIO1_A6/SPI0_SCK: RK3188-SOM-EVB_PLATFORM1.4-28(GPIO1_A6/UART1_CTSN/SPI0_CLK) UEXT1.9
GPIO1_A7/SPI0_CSN0: R11.1 RK3188-SOM-EVB_PLATFORM1.4-26(GPIO1_A7/UART1_RTSN/SPI0_CSN0) UEXT1.10
GPIO1_B2/UART3_RX: R57.1 RK3188-SOM-EVB_PLATFORM1.3-9(GPIO1_B2/UART3_RX/GPS_MAG) UEXT2.4
GPIO1_B3/UART3_TX: RK3188-SOM-EVB_PLATFORM1.3-11(GPIO1_B3/UART3_TX/GPS_SIG) UEXT2.3
GPIO1_B4: EXT1.35 RK3188-SOM-EVB_PLATFORM1.3-13(GPIO1_B4/UART3_CTSN/GPS_CLK)
GPIO1_B5: EXT1.37 RK3188-SOM-EVB_PLATFORM1.3-15(GPIO1_B5/UART3_RTSN)
GPIO1_B6/SPDIF_TX: RK3188-SOM-EVB_PLATFORM1.3-17(GPIO1_B6/SPDIF_TX/SPI1_CSN1) U8.2(I2S3/SPDIF)
GPIO1_B7/SDO: EXT1.39 R62.2 RK3188-SOM-EVB_PLATFORM1.3-19(GPIO1_B7/SPI0_CSN1)
GPIO1_C0: EXT1.31 RK3188-SOM-EVB_PLATFORM1.1-3(GPIO1_C0/I2S0_CLK)
GPIO1_C1/I2S0_SCLK: RK3188-SOM-EVB_PLATFORM1.1-5(GPIO1_C1/I2S0_SCLK) U8.7(SCK/MCLK)
GPIO1_C2/I2S0_LRCK_RX: R49.1 RK3188-SOM-EVB_PLATFORM1.1-7(GPIO1_C2/I2S0_LRCK_RX)
GPIO1_C3/I2S0_LRCK_TX: R47.1 RK3188-SOM-EVB_PLATFORM1.1-4(GPIO1_C3/I2S0_LRCK_TX)
GPIO1_C4: EXT1.33 RK3188-SOM-EVB_PLATFORM1.1-6(GPIO1_C4/I2S0_SDI)
GPIO1_C5/I2S0_SDO0: RK3188-SOM-EVB_PLATFORM1.2-5(GPIO1_C5/I2S_SDO) U8.5(I2S0)
GPIO1_D0/I2C0_SDA: R10.1 RK3188-SOM-EVB_PLATFORM1.3-31(GPIO1_D0/I2C0_SDA) UEXT1.6
GPIO1_D1/I2C0_SCL: R8.1 RK3188-SOM-EVB_PLATFORM1.3-33(GPIO1_D1/I2C0_SCL) UEXT1.5
GPIO1_D4/I2C2_SDA: R37.1 RK3188-SOM-EVB_PLATFORM1.3-35(GPIO1_D4/I2C2_SDA) U8.11(PCSDA)
GPIO1_D5/I2C2_SCL: R39.1 RK3188-SOM-EVB_PLATFORM1.3-37(GPIO1_D5/I2C2_SCL) U8.12(PCSCL)
GPIO1_D6/I2C4_SDA: R4.1 RK3188-SOM-EVB_PLATFORM1.2-39(GPIO1_D6/I2C4_SDA) UEXT2.6
GPIO1_D7/I2C4_SCL: R3.1 RK3188-SOM-EVB_PLATFORM1.2-40(GPIO1_D7/I2C4_SCL) UEXT2.5
GPIO2_A0/LCD1_D0: RK3188-SOM-EVB_PLATFORM1.2-23(GPIO2_A0/LCD1_D0/SMC_D0/TRACE_DATA0) U8.61(D0)
GPIO2_A1/LCD1_D1: RK3188-SOM-EVB_PLATFORM1.2-25(GPIO2_A1/LCD1_D1/SMC_D1/TRACE_DATA1) U8.60(D1)
GPIO2_A2/LCD1_D2: RK3188-SOM-EVB_PLATFORM1.2-27(GPIO2_A2/LCD1_D2/SMC_D2/TRACE_DATA2) U8.59(D2)
GPIO2_A3/LCD1_D3: RK3188-SOM-EVB_PLATFORM1.2-29(GPIO2_A3/LCD1_D3/SMC_D3/TRACE_DATA3) U8.58(D3)
GPIO2_A4/LCD1_D4: RK3188-SOM-EVB_PLATFORM1.2-31(GPIO2_A4/LCD1_D4/SMC_D4/TRACE_DATA4) U8.57(D4)
GPIO2_A5/LCD1_D5: RK3188-SOM-EVB_PLATFORM1.2-33(GPIO2_A5/LCD1_D5/SMC_D5/TRACE_DATA5) U8.55(D5)
GPIO2_A6/LCD1_D6: RK3188-SOM-EVB_PLATFORM1.2-35(GPIO2_A6/LCD1_D6/SMC_D6/TRACE_DATA6) U8.54(D6)
GPIO2_A7/LCD1_D7: RK3188-SOM-EVB_PLATFORM1.2-37(GPIO2_A7/LCD1_D7/SMC_D7/TRACE_DATA7) U8.53(D7)
GPIO2_B0/LCD1_D8: RK3188-SOM-EVB_PLATFORM1.2-7(GPIO2_B0/LCD1_D8/SMC_D8/TRACE_DATA8) U8.52(D8)
GPIO2_B1/LCD1_D9: RK3188-SOM-EVB_PLATFORM1.2-9(GPIO2_B1/LCD1_D9/SMC_D9/TRACE_DATA9) U8.50(D9)
GPIO2_B2/LCD1_D10: RK3188-SOM-EVB_PLATFORM1.2-11(GPIO2_B2/LCD1_D10/SMC_D10/TRACE_DATA10) U8.49(D10)
GPIO2_B3/LCD1_D11: RK3188-SOM-EVB_PLATFORM1.2-13(GPIO2_B3/LCD1_D11/SMC_D11/TRACE_DATA11) U8.48(D11)
GPIO2_B4/LCD1_D12: RK3188-SOM-EVB_PLATFORM1.2-15(GPIO2_B4/LCD1_D12/SMC_D12/TRACE_DATA12) U8.47(D12)
GPIO2_B5/LCD1_D13: RK3188-SOM-EVB_PLATFORM1.2-17(GPIO2_B5/LCD1_D13/SMC_D13/TRACE_DATA13) U8.46(D13)
GPIO2_B6/LCD1_D14: RK3188-SOM-EVB_PLATFORM1.2-19(GPIO2_B6/LCD1_D14/SMC_D14/TRACE_DATA14) U8.45(D14)
GPIO2_B7/LCD1_D15: RK3188-SOM-EVB_PLATFORM1.2-21(GPIO2_B7/LCD1_D15/SMC_D15/TRACE_DATA15) U8.44(D15)
GPIO2_C0/LCD1_D16: RK3188-SOM-EVB_PLATFORM1.2-38(GPIO2_C0/LCD1_D16/SMC_A0/TRACE_CLK) U8.43(D16)
GPIO2_C1/LCD1_D17: RK3188-SOM-EVB_PLATFORM1.2-36(GPIO2_C1/LCD1_D17/SMC_A1/TRACE_CTL) U8.42(D17)
GPIO2_C2/LCD1_D18: RK3188-SOM-EVB_PLATFORM1.2-34(GPIO2_C2/LCD1_D18/SMC_A2) U8.41(D18)
GPIO2_C3/LCD1_D19: RK3188-SOM-EVB_PLATFORM1.2-32(GPIO2_C3/LCD1_D19/SMC_A3) U8.40(D19)
GPIO2_C4/LCD1_D20: RK3188-SOM-EVB_PLATFORM1.2-30(GPIO2_C4/LCD1_D20/SMC_A4) U8.39(D20)
GPIO2_C5/LCD1_D21: RK3188-SOM-EVB_PLATFORM1.2-28(GPIO2_C5/LCD1_D21/SMC_A5) U8.38(D21)
GPIO2_C6/LCD1_D22: RK3188-SOM-EVB_PLATFORM1.2-26(GPIO2_C6/LCD1_D22/SMC_A6) U8.37(D22)
GPIO2_C7/LCD1_D23: RK3188-SOM-EVB_PLATFORM1.2-24(GPIO2_C7/LCD1_D23/SMC_A7) U8.36(D23)
GPIO2_D0/LCD1_DCLK: RK3188-SOM-EVB_PLATFORM1.2-22(GPIO2_D0/LCD1_DCLK/SMC_CSN0) U8.51(PCLK)
GPIO2_D1/LCD1_DEN: RK3188-SOM-EVB_PLATFORM1.2-20(GPIO2_D1/LCD1_DEN/SMC_WEN) U8.62(DE)
GPIO2_D2/LCD1_HSYNC: RK3188-SOM-EVB_PLATFORM1.2-18(GPIO2_D2/LCD1_HSYNC/SMC_OEN) U8.63(HSYNC)
GPIO2_D3/LCD1_VSYNC: RK3188-SOM-EVB_PLATFORM1.2-16(GPIO2_D3/LCD1_VSYNC/SMC_ADVN) U8.64(VSYNC)
GPIO2_D4: EXT2.35 RK3188-SOM-EVB_PLATFORM1.2-14(GPIO2_D4/SMC_BLS_N0)
GPIO2_D5: EXT2.36 RK3188-SOM-EVB_PLATFORM1.2-12(GPIO2_D5/SMC_BLS_N1)
GPIO2_D6/HDMI_INT: R36.1 RK3188-SOM-EVB_PLATFORM1.2-10(GPIO2_D6/SMC_CSN1) U8.10(INT)
GPIO2_D7/USB-OTG-DRV: R55.2 RK3188-SOM-EVB_PLATFORM1.2-8(GPIO2_D7) U10.4(EN)
GPIO3_A0: EXT2.37 RK3188-SOM-EVB_PLATFORM1.4-24(GPIO3_A0/SDMMC0_RSTN)
GPIO3_B1: EXT2.38 RK3188-SOM-EVB_PLATFORM1.3-24(GPIO3_B1/SDMMC0_WP)
GPIO3_B2/HDMI_RST: RK3188-SOM-EVB_PLATFORM1.3-26(GPIO3_B2) U8.33(SYSRSTN)
GPIO3_C0/RMII_TXEN: RK3188-SOM-EVB_PLATFORM1.3-28(GPIO3_C0/SDMMC1_CMD/RMII_TX_EN) U3.21(TXEN)
GPIO3_C1/RMII_TXD1: RK3188-SOM-EVB_PLATFORM1.3-30(GPIO3_C1/SDMMC1_D0/RMII_TX_D1) U3.23(TXD1)
GPIO3_C2/RMII_TXD0: RK3188-SOM-EVB_PLATFORM1.3-32(GPIO3_C2/SDMMC1_D1/RMII_TX_D0) U3.22(TXD0)
GPIO3_C3/RMII_RXD0: RK3188-SOM-EVB_PLATFORM1.3-34(GPIO3_C3/SDMMC1_D2/RMII_RX_D0) RM2.2.2 U3.11(RXD0/MODE0)
GPIO3_C4/RMII_RXD1: RK3188-SOM-EVB_PLATFORM1.3-36(GPIO3_C4/SDMMC1_D3/RMII_RX_D1) RM2.1.2 U3.10(RXD1/MODE1)
GPIO3_C5/RMII_CLK: R13.1(1.1) RK3188-SOM-EVB_PLATFORM1.3-38(GPIO3_C5/SDMMC1_CLKO/RMII_CLKO/RMII_CLKIN)
GPIO3_C6/RMII_RX_ERR/PHYAD0: RK3188-SOM-EVB_PLATFORM1.3-40(GPIO3_C6/SDMMC1_DET/RMII_RX_ERR) RM1.4.1 U3.13(RXER/RXD4/PHYAD0)
GPIO3_C7/RMII_CRS_DVALID: RK3188-SOM-EVB_PLATFORM1.3-39(GPIO3_C7/SDMMC1_WP/RMII_CSR_VALID) RM2.3.2 U3.15(COL/CRS_DV/MODE2)
GPIO3_D0/RMII_MDIO: RK3188-SOM-EVB_PLATFORM1.3-21(GPIO3_D0/SDMMC1_PWR/MII_MD) RM2.4.2 U3.16(MDIO)
GPIO3_D1/RMII_MDC: RK3188-SOM-EVB_PLATFORM1.3-23(GPIO3_D1/SDMMC1_BACKEND/MII_MDCLK) U3.17(MDC)
GPIO3_D2/RMII_INT: R27.1 R28.1 RK3188-SOM-EVB_PLATFORM1.3-25(GPIO3_D2/SDMMC1_INT)
GPIO3_D4/PWM1: LCD.36 RK3188-SOM-EVB_PLATFORM1.LCD-36(GPIO3_D4/PWM1/JTAG_TRSTN)
GPIO3_D5/PWM2: EXT1.22 RK3188-SOM-EVB_PLATFORM1.3-27(GPIO3_D5/PWM2/JTAG_TCK/OTG_DRV_VBUS)
GPIO3_D6: EXT1.24 RK3188-SOM-EVB_PLATFORM1.3-29(GPIO3_D6/PWM3/JTAG_TMS/HOST_DRV_VBUS)
GPIO3_D7/LCD0_PWRE: LCD.35 RK3188-SOM-EVB_PLATFORM1.LCD-35(GPIO3_D7)
HCEC: HDMI.13 R52.1 U5.1(IN1) U5.10(OUT1) U8.17(CEC)
HDMI_5V_SOURCE: FUSE1.2 HDMI.18
HHPD: HDMI.19 R41.1 U5.5(IN4) U5.6(OUT4) U8.14(HPD)
HSCL: HDMI.15 R48.1 R50.1 U5.2(IN2) U5.9(OUT2)
HSDA: HDMI.16 R45.1 R46.1 U5.4(IN3) U5.7(OUT3)
HTX0N: HDMI.9 U7.2(IN2) U7.9(OUT2) U8.24(TX0M)
HTX0P: HDMI.7 U7.1(IN1) U7.10(OUT1) U8.25(TX0P)
HTX1N: HDMI.6 U8.26(TX1M) U9.5(IN4) U9.6(OUT4)
HTX1P: HDMI.4 U8.27(TX1P) U9.4(IN3) U9.7(OUT3)
HTX2N: HDMI.3 U8.29(TX2M) U9.2(IN2) U9.9(OUT2)
HTX2P: HDMI.1 U8.30(TX2P) U9.1(IN1) U9.10(OUT1)
HTXCN: HDMI.12 U7.5(IN4) U7.6(OUT4) U8.21(TXCM)
HTXCP: HDMI.10 U7.4(IN3) U7.7(OUT3) U8.22(TXCP)
I2C1_SCL: R20.1 RK3188-SOM-EVB_PLATFORM1.2-3(GPIO1_D3/I2C1_SCL) U2.6(SCL)
I2C1_SDA: R19.1 RK3188-SOM-EVB_PLATFORM1.2-4(GPIO1_D2/I2C1_SDA) U2.5(SDA)
I2S0_LRCK: R47.2 R49.2 U8.6(WS)
LCD0_CLK: LCD.31 RK3188-SOM-EVB_PLATFORM1.LCD-31(LCD0_DCLK)
LCD0_D0: LCD.21 RK3188-SOM-EVB_PLATFORM1.LCD-21(LCD0_D0)
LCD0_D1: LCD.22 RK3188-SOM-EVB_PLATFORM1.LCD-22(LCD0_D1)
LCD0_D2: LCD.23 RK3188-SOM-EVB_PLATFORM1.LCD-23(LCD0_D2)
LCD0_D3: LCD.24 RK3188-SOM-EVB_PLATFORM1.LCD-24(LCD0_D3)
LCD0_D4: LCD.25 RK3188-SOM-EVB_PLATFORM1.LCD-25(LCD0_D4)
LCD0_D5: LCD.26 RK3188-SOM-EVB_PLATFORM1.LCD-26(LCD0_D5)
LCD0_D6: LCD.27 RK3188-SOM-EVB_PLATFORM1.LCD-27(LCD0_D6)
LCD0_D7: LCD.28 RK3188-SOM-EVB_PLATFORM1.LCD-28(LCD0_D7)
LCD0_D8: LCD.13 RK3188-SOM-EVB_PLATFORM1.LCD-13(LCD0_D8)
LCD0_D9: LCD.14 RK3188-SOM-EVB_PLATFORM1.LCD-14(LCD0_D9)
LCD0_D10: LCD.15 RK3188-SOM-EVB_PLATFORM1.LCD-15(LCD0_D10)
LCD0_D11: LCD.16 RK3188-SOM-EVB_PLATFORM1.LCD-16(LCD0_D11)
LCD0_D12: LCD.17 RK3188-SOM-EVB_PLATFORM1.LCD-17(LCD0_D12)
LCD0_D13: LCD.18 RK3188-SOM-EVB_PLATFORM1.LCD-18(LCD0_D13)
LCD0_D14: LCD.19 RK3188-SOM-EVB_PLATFORM1.LCD-19(LCD0_D14)
LCD0_D15: LCD.20 RK3188-SOM-EVB_PLATFORM1.LCD-20(LCD0_D15)
LCD0_D16: LCD.5 RK3188-SOM-EVB_PLATFORM1.LCD-5(LCD0_D16)
LCD0_D17: LCD.6 RK3188-SOM-EVB_PLATFORM1.LCD-6(LCD0_D17)
LCD0_D18: LCD.7 RK3188-SOM-EVB_PLATFORM1.LCD-7(LCD0_D18)
LCD0_D19: LCD.8 RK3188-SOM-EVB_PLATFORM1.LCD-8(LCD0_D19)
LCD0_D20: LCD.9 RK3188-SOM-EVB_PLATFORM1.LCD-9(LCD0_D20)
LCD0_D21: LCD.10 RK3188-SOM-EVB_PLATFORM1.LCD-10(LCD0_D21)
LCD0_D22: LCD.11 RK3188-SOM-EVB_PLATFORM1.LCD-11(LCD0_D22)
LCD0_D23: LCD.12 RK3188-SOM-EVB_PLATFORM1.LCD-12(LCD0_D23)
LCD0_DE: LCD.32 RK3188-SOM-EVB_PLATFORM1.LCD-32(LCD0_DEN)
LCD0_HSYNC: LCD.29 RK3188-SOM-EVB_PLATFORM1.LCD-29(LCD0_HSYNC)
LCD0_VSYNC: LCD.30 RK3188-SOM-EVB_PLATFORM1.LCD-30(LCD0_VSYNC)
LCD_L/R: LCD.33 RK3188-SOM-EVB_PLATFORM1.LCD-33(LCD_LEFT/RIGHT)
LCD_U/D: LCD.34 RK3188-SOM-EVB_PLATFORM1.LCD-34(LCD_UP/DOWN)
N$1: R62.1 U11.9(SDO)
N$2 [PWR]: C214.1 LAN.GND1 LAN.GND2
N$18: CD1.1(E/D) R12.2
N$21: LAN.2(TD-) R22.1 U3.28(TXN)
N$22: LAN.KG U3.2(LED2/NINTSEL)
N$24: C13.2 C14.2 U3.6(VDDCR)
N$31: C10.2 R16.2 R17.2 U3.19(NRST)
N$32: R43.2 U6.3(ISET)
N$33: R31.2 U4.4(RREF)
N$34: C39.1 L7.2 USB_HOST1.1
N$35: R42.1 U8.20(REXT)
N$36: R40.1 U8.31(ENTEST)
N$37: C32.2 R32.1 R34.1 U4.13(#RESET)
N$38: L8.2 USB_HOST1.P$3 USB_HOST1.P$4 USB_HOST2.P$3 USB_HOST2.P$4 USB_HOST3.P$3 USB_HOST3.P$4 USB_HOST4.P$3 USB_HOST4.P$4
N$39: C22.1 L3.2 USB_HOST4.1
N$40: C23.2 C30.2 C34.2 C38.2 C59.2 C60.2 C61.2 C62.2 C68.+ C190.+ L3.1 L5.1 L6.1 L7.1 R30.2 U6.1(OUT)
N$41: LAN.1(TD+) R21.1 U3.29(TXP)
N$44: LAN.7(RD+) R23.1 U3.31(RXP)
N$45: C4.1 U1.8(SS)
N$46: R7.2 U1.7(EN)
N$47: C36.1 L6.2 USB_HOST2.1
N$48: C31.1 L5.2 USB_HOST3.1
N$49: LAN.8(RD-) R24.1 U3.30(RXN)
N$50: R33.2 U4.17(PSELF)
N$51: C8.1 U1.1(BS)
N$52: C8.2 L1.1 U1.3(SW)
N$53: C50.1 C51.1 C52.1 C53.1 L11.2 U8.9(VCC33) U8.13(OVDD33) U8.19(PVCC33)
N$54: LAN.AY U3.3(LED1/REGOFF)
N$55: R15.2 U3.32(RBIAS)
N$56: C9.2 LAN.3(COM) LAN.6(NC) R26.1(1.1)
N$57: LAN.KY R14.1
N$59: C15.2 C16.2 C17.2 L2.1 R21.2 R22.2 R23.2 R24.2 R25.1 R26.2(1.2) U3.1(VDD2A) U3.27(VDD1A)
N$60: C7.1 U1.6(COMP)
N$61: R48.2 U8.16(DDCSCL)
N$62: R45.2 U8.15(DDCSDA)
N$63: R27.2 U3.18(NINT/TXER/TXD4)
N$64: C7.2 R1.1
N$65: LAN.AG R25.2
N$66: R2.1 R6.1 U1.5(FB)
N$67: C1.1 C2.1 C5.1 C6.1 D2.A FET1.1(G) L1.2 R6.2
N$68: 5V_E.1 D2.K(C) FET1.2(S)
N$77: R38.1 U8.32(PCADR)
N$105: R35.2 U4.18(PGANG)
N$115: R54.2 U10.3(ISET)
N$124: C12.1 Q1.1 U2.1(OSCI)
N$129: PWR_LED.A R5.2
N$133: Q1.4 U2.2(OSCO)
N$136: 3.0V_BAT.1+(+) 3.0V_BAT.+ D3.2(A2)
N$137: C55.1 C63.1 L10.2 R56.2 U10.1(OUT)
N$266: L9.2 USB_OTG.GND1 USB_OTG.GND2 USB_OTG.GND3 USB_OTG.GND4
NALE: EXT1.12 RK3188-SOM-EVB_PLATFORM1.4-18(FLASH_ALE)
NCE0: EXT1.16 RK3188-SOM-EVB_PLATFORM1.4-22(FLASH_CSN0)
NCLE: EXT1.10 RK3188-SOM-EVB_PLATFORM1.4-16(FLASH_CLE)
NDQ0: EXT1.7 RK3188-SOM-EVB_PLATFORM1.4-9(FLASH_D0/EMMC_D0)
NDQ1: EXT1.9 RK3188-SOM-EVB_PLATFORM1.4-11(FLASH_D1/EMMC_D1)
NDQ2: EXT1.11 RK3188-SOM-EVB_PLATFORM1.4-13(FLASH_D2/EMMC_D2)
NDQ3: EXT1.13 RK3188-SOM-EVB_PLATFORM1.4-15(FLASH_D3/EMMC_D3)
NDQ4: EXT1.15 RK3188-SOM-EVB_PLATFORM1.4-17(FLASH_D4/EMMC_D4)
NDQ5: EXT1.17 RK3188-SOM-EVB_PLATFORM1.4-19(FLASH_D5/EMMC_D5)
NDQ6: EXT1.19 RK3188-SOM-EVB_PLATFORM1.4-21(FLASH_D6/EMMC_D6)
NDQ7: EXT1.21 RK3188-SOM-EVB_PLATFORM1.4-23(FLASH_D7/EMMC_D7)
NRB0: EXT1.6 RK3188-SOM-EVB_PLATFORM1.4-7(FLASH_RDY)
NRE: EXT1.8 RK3188-SOM-EVB_PLATFORM1.4-14(FLASH_RDN)
NWE: EXT1.14 RK3188-SOM-EVB_PLATFORM1.4-20(FLASH_WRN)
NWP: EXT1.5 RK3188-SOM-EVB_PLATFORM1.4-5(FLASH_WP/EMMC_PWR)
OTG_DM: RK3188-SOM-EVB_PLATFORM1.4-8(OTG_DM) USB_OTG.D-
OTG_DP: RK3188-SOM-EVB_PLATFORM1.4-6(OTG_DP) USB_OTG.D+
OTG_ID: RK3188-SOM-EVB_PLATFORM1.4-3(OTG_ID) USB_OTG.ID
OTG_VBUS: C56.1 R53.2 R56.1 RK3188-SOM-EVB_PLATFORM1.4-4(OTG_VBUS)
PHYAD1: RM1.3.1 U3.7(RXCLK/PHYAD1)
PHYAD2: RM1.2.1 U3.8(RXD3/PHYAD2)
RESET: EXT2.4 RK3188-SOM-EVB_PLATFORM1.2-6(RESET)
RMII_REF_CLK_50MHZ: CD1.3(OUT) R13.2(1.2) U3.5(XTAL1/CLKIN)
RMIISEL: RM1.1.1 U3.9(RXD2/RMIISEL)
RTC_CLKOUT: R18.1 RK3188-SOM-EVB_PLATFORM1.3-6(CLK32K_IN) U2.7(CLKOUT)
RTC_INT: RK3188-SOM-EVB_PLATFORM1.1-16(GPIO0_B5) U2.3(#INT)
RTC_VDD: C11.2 D3.3(K) U2.8(VDD)
USB-HOST_DM: RK3188-SOM-EVB_PLATFORM1.4-10(HOST_DM) U4.25(DM0)
USB-HOST_DP: RK3188-SOM-EVB_PLATFORM1.4-12(HOST_DP) U4.26(DP0)
VCC [PWR]: C47.1 C48.1 C49.1 C64.1 C65.1 D3.1(A1) EXT2.1 EXT2.3 L11.1 LCD.3 R3.2 R4.2 R8.2 R9.2 R10.2 R11.2 R18.2 R19.2 R20.2 R36.2 R37.2 R39.2 R51.1 R52.2 R57.2 R58.2 R60.2 R61.2 RK3188-SOM-EVB_PLATFORM1.2-1(+3.3V) RK3188-SOM-EVB_PLATFORM1.LCD-3(+3.3V) U8.1(OVDD) U8.34(OVDD) U11.1(VDD) UEXT1.1 UEXT2.1 ; supply symbol labelled 3.3V
VDD: C18.2 C19.2 C20.2 CD1.4(VDD) L2.2 R12.1 R16.1 R28.2 RK3188-SOM-EVB_PLATFORM1.3-2(VDD_PHY) RM1.1.2 RM2.1.1 RM2.2.1 RM2.3.1 RM2.4.1 U3.12(VDDIO) ; supply symbol labelled 3.3V_PHY
VDD_HDMI: C40.1 C41.1 C42.1 C43.1 C44.1 C45.1 C46.1 RK3188-SOM-EVB_PLATFORM1.3-1(VDD_HDMI) U8.8(IVDD12) U8.18(PVCC12) U8.23(AVCC12) U8.28(DVDD12) U8.35(IVDD12) U8.56(IVDD12)
VPP [PWR]: EXT1.1 RK3188-SOM-EVB_PLATFORM1.3-3(VCC_1.8) ; supply symbol labelled VCC_1.8
WAKE: R59.1 U11.5(WAKE)
X1: C24.2 Q2.2 U4.6(X1)
X2: C21.2 Q2.1 U4.7(X2)
X+: LCD.38 U11.18(X+)
X-: C67.2 LCD.37 R59.2 U11.19(X-)
Y+: LCD.40 U11.15(Y+)
Y-: C66.2 LCD.39 U11.16(Y-)
Unconnected: HDMI.14 RK3188-SOM-EVB_PLATFORM1.LCD-37(NC) RK3188-SOM-EVB_PLATFORM1.LCD-38(NC) RK3188-SOM-EVB_PLATFORM1.LCD-39(NC) RK3188-SOM-EVB_PLATFORM1.LCD-40(NC) U3.4(XTAL2) U3.14(CRS) U3.20(TXCLK) U3.26(RXDV) U4.19(#OVCUR2) U4.20(#PWREN2) U4.22(#PWREN1) U8.3(I2S2) U8.4(I2S1) U11.6(SIQ) U11.10(NC) U11.12(NC)

## Buses
LCD_D[0..7],LCD_D[8..15],LCD_D[16..23],LCD_HSYNC,LCD_VSYNC,LCD_CLK,LCD_DE
B$1
B$2
B$4
B$5
FSDF

## Notes on the sheet
- LOKUM BOOK -R1 ROCKCHIP RK3188 ARM CPU REV.A MURAT IRKAN 2024 /01
- USB-OTG
- HDMI
- I2C Slave Address: 0x98 (PCADR=Low)
- Iset = 6800/R68
- Iset = 523mA
- USB-HOSTs
- Iset = 6800/R43
- Iset = 1000mA
- Notes:
- =====
- Ethernet
- 1. PWREN1# is the only power- | 3. Gang mode means that power
- enable output for GANG mode; | management affects whole 4
- ports as a group;
- 2. OVCUR1# is the only over | 4. Individual power management,
- current flag for GANG mode; | i.e. individual mode is not
- supported on SSOP28 package!
- RTC_MODULE
- I2C Slave Address: 0xA3 (Read), 0xA2 (Write)
- Compatible with HYM8563
- UEXT1
- The PHY is setted up as follows:
- MODE(111): All capable(10/100Base).
- Auto-negotiation enabled.
- RMII Configuration
- SMI address: 0x00
- 5.0V | GND
- 3.3V | GND
- UEXT2
- R0 | R1
- R2 | R3
- R4 | R5
- R6 | R7
- G0 | G1
- G2 | G3
- G4 | G5
- G6 | G7
- B0 | B1
- EXTENSIONs
- B2 | B3
- B4 | B5
- B6 | B7
- HSYNC | VSYNC
- CLK | DE
- L/R | U/D
- PWRE | BKL
- X1 | X2
- Y1 | Y2
- Power Supply
- Ra
- 6-16VDC
- Rb
- Vout=0.923x(1+Ra/Rb)

## Library data of the parts
3.0V_BAT = DOUBLE-SIDE:B: LI BATTERY Varta
5V_E = jumper:SJ: SMD solder JUMPER
C1 C2 C4-C67 C214 = rcl:C-EU: CAPACITOR, European symbol
C3 C68 C190 = rcl:CPOL-EU: POLARIZED CAPACITOR, European symbol
CD1 = gogo:6NC2_CLOCK_DRIVER
D1 = OLIMEX_DISCRET:SMBJ16A
D2 = gogo:SCHOTKKY7.62SS
D3 = semicon-smd-ipc:DIODE_AC-CA_: DUAL DIODE
EXT1 EXT2 LCD = con-harting-ml:ML40: HARTING
FET1 = Penko:P-MOS+DIOD
FID1 FID3 FID4 = SparkFunEagle-6-6-07:FIDUCIAL: Fiducial Alignment Points Various fiducial points for machine vision alignment.
FUSE1 = gogo:FUSE
GND_PIN = gogo:TESTPAD: drill 40mils, diameter 70mils
HDMI = OLIMEX_CONNECTORS:HDMI-MC34931
L1 = OLIMEX_DISCRET:L
L2-L11 = rcl:L-US: INDUCTOR, American symbol
LAN = OLIMEX_CONNECTORS:RJLBC-060TC1_GND
PWR = gogo:PWR-JAK
PWR_LED = DOUBLE-SIDE:LED
Q1 = crystal:MC-306
Q2 = crystal:HC49/S: CRYSTAL
R1-R12 R14-R25 R27-R62 = rcl:R-EU_: RESISTOR, European symbol
R13 R26 = OLIMEX_DISCRET:R_0R
RK3188-SOM-EVB_PLATFORM1 = OLIMEX_CASES:RK3188-SOM-EVB_REV_B
RM1 RM2 = OLIMEX_DISCRET:R_MATRIX_4E
U1 = OLIMEX_IC:MP1482
U2 = OLIMEX_IC:PCF8563: Real-time clock/calendar
U3 = OLIMEX_IC:LAN8710A: LAN8710A/LAN8710Ai Small Footprint MII/RMII 10/100 Ethernet Transceiver with HP Auto-MDIX and flexPWR® Technology
U4 = OLIMEX_IC:GL850G
U5 U7 U9 = OLIMEX_IC:RCLAMP0524P
U6 U10 = OLIMEX_IC:SY6280
U8 = OLIMEX_IC:IT66121FN: IT66121FN Low Power Transmitter with HDMI1.4 3D Single channel HDMI transmitter; Compliant with HDMI1.3a, HDCP 1.2 and DVI 1.0 specifications; Supporting pixel rates: from 25MHz to 165MHz; DTV resolutions: 480i, 576i, 480p, 576p, 720p, 1080i up to 1080p; PC resolutions: VGA, SVGA, XGA, SXGA up to UXGA; Various video input interface supporting digital video standarts; Support HDMI1.4 3D feature; Bi-direction Color Space Conversion (CSC) between RGB and YCbCr color spaces with programmable coefficients; Digital audio input interface supporting: - audio sample rate: 32 - 192 kHz - sample size: 16 - 24 bits - four I2S interfaces supporting 8-channel audio - S/PDIF interface supporting PCM, Dolby Digital, DTS digital audio transmission at up to 192kHz - support for high-bit-rate (HBR) audio such as DTS-HD and Dolby TrueHD Power consumption: operation power is less than 70mW at 1080p@60Hz format.
U11 = OLIMEX_IC:AR1020: MICROCHIP AR1000 Series Resistive Touch Screen Controller
UEXT1 UEXT2 = con-harting-ml:ML10: HARTING
USB_HOST1-USB_HOST4 = OLIMEX_CONNECTORS:USB_SHIELD
USB_OTG = OLIMEX_CONNECTORS:MINI_USB9

## Net classes
2 lan_sh: clearance 0.762 mm